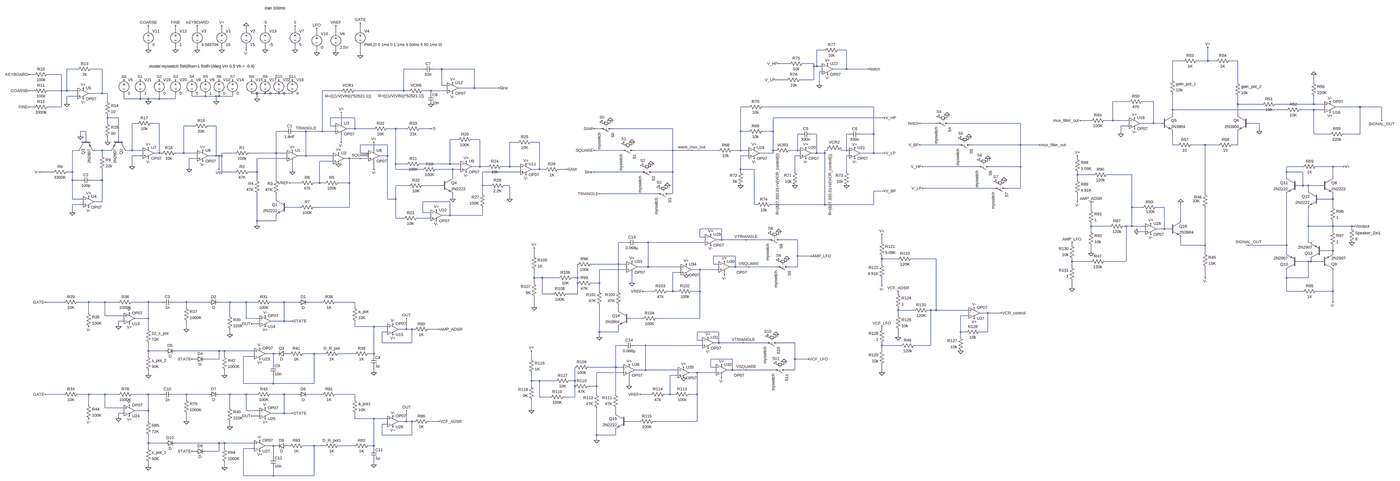
[diagram p0: schematic Synthesizer_Schematic.asc, whole sheet]
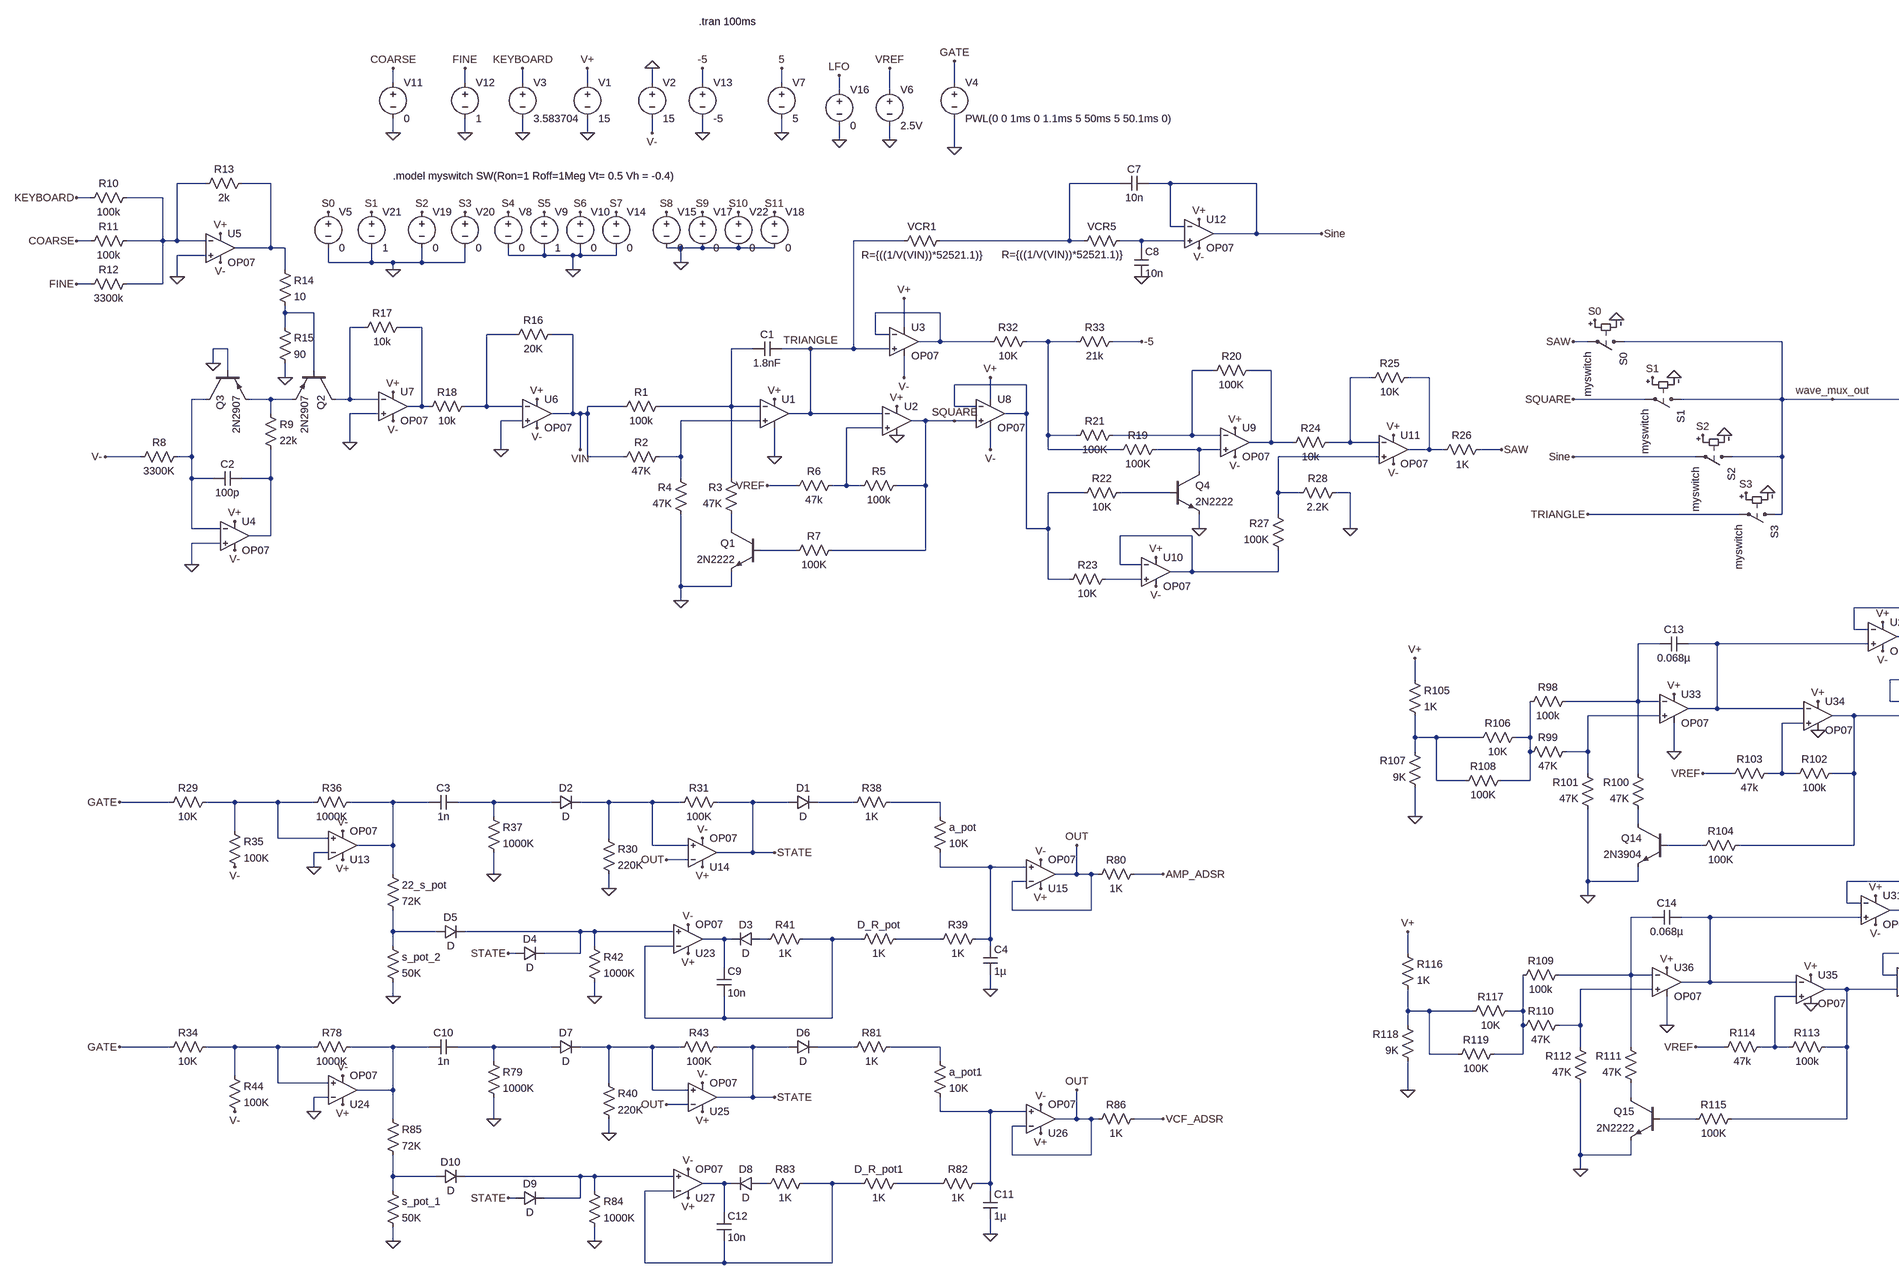
[diagram p1: schematic Synthesizer_Schematic.asc, part, row 1 of 1, column 1 of 2]
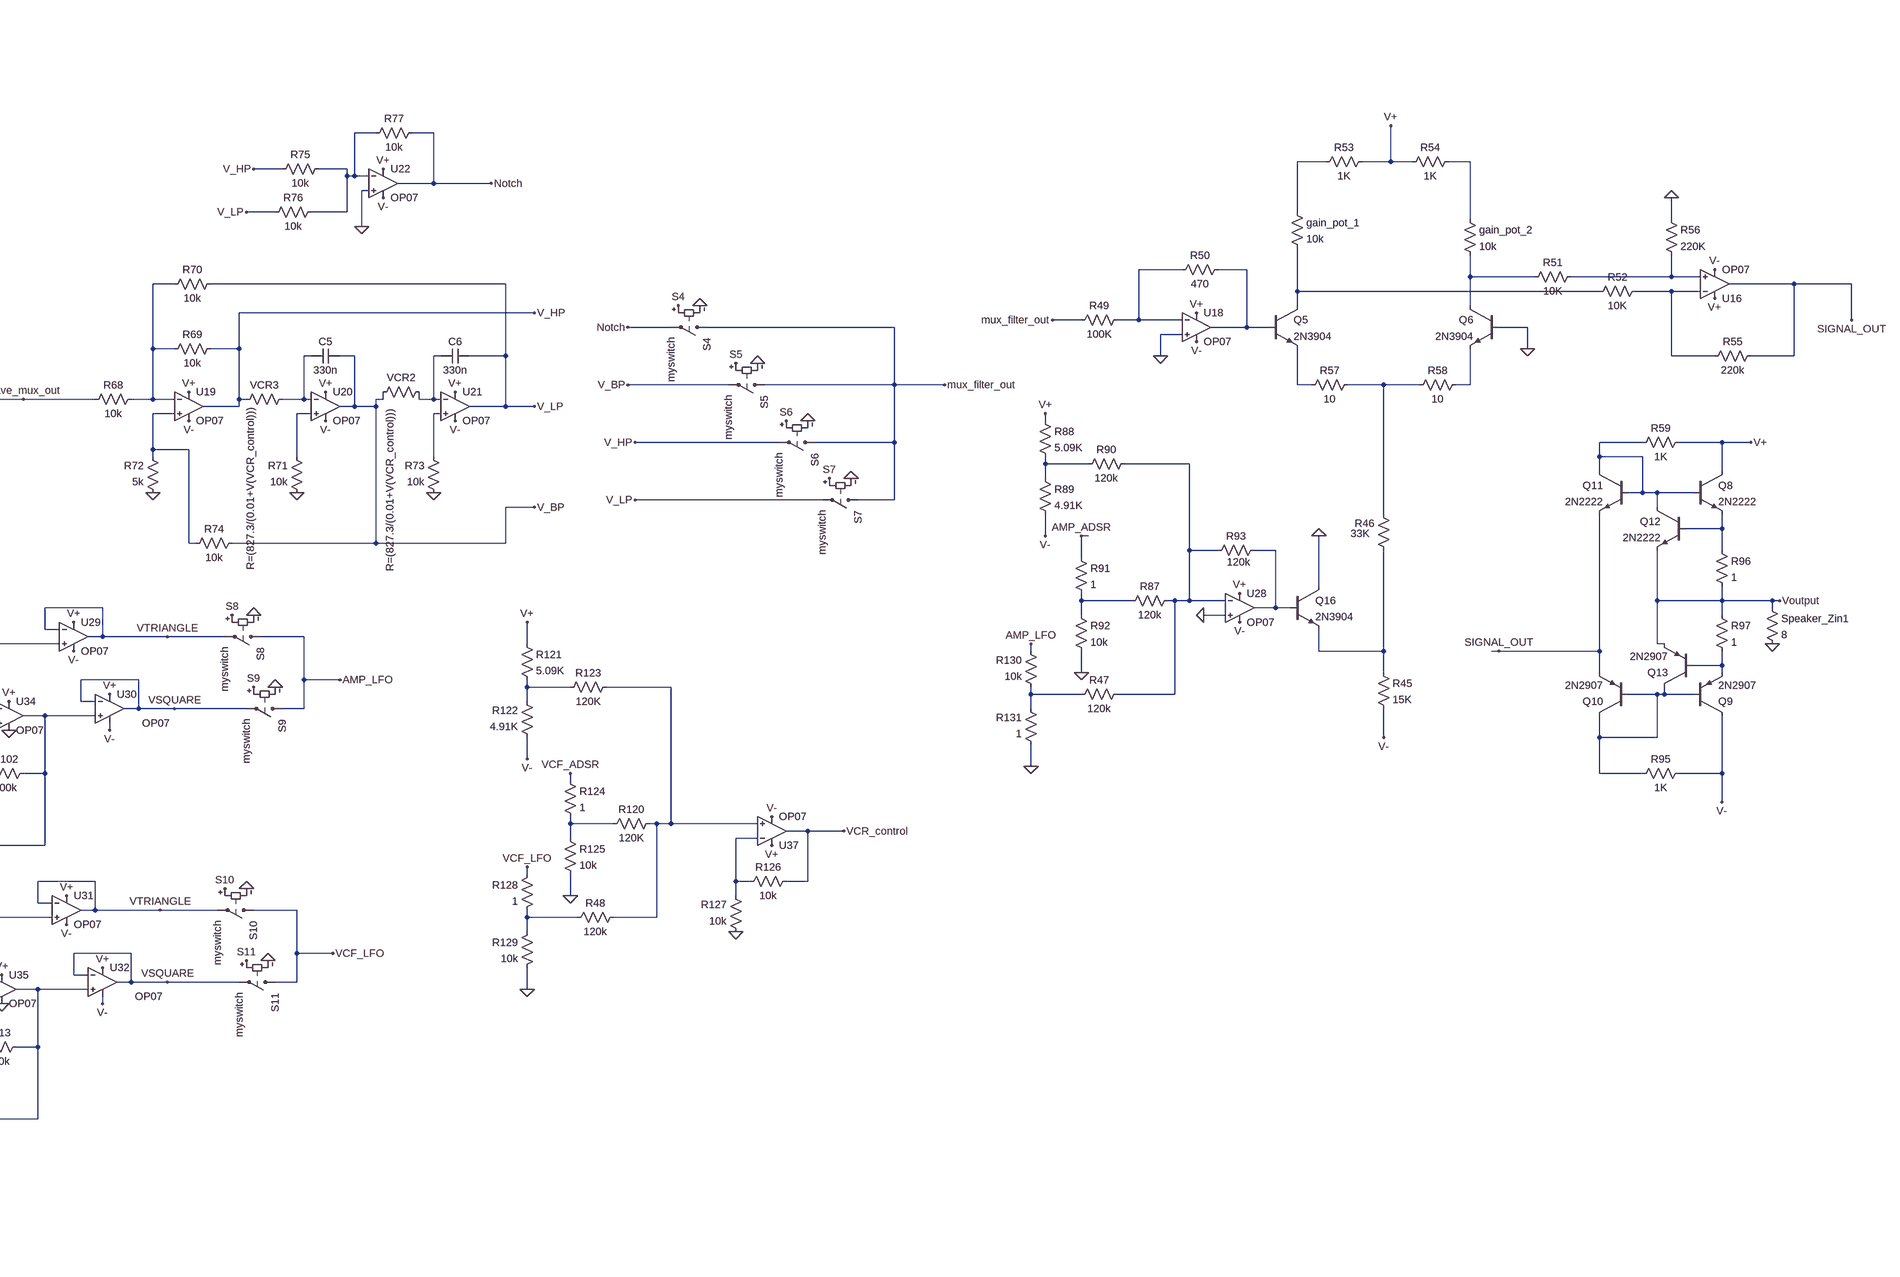
[diagram p2: schematic Synthesizer_Schematic.asc, part, row 1 of 1, column 2 of 2]
* Synthesizer_Schematic.asc
V1 V+ 0 15
V2 0 V- 15
V3 KEYBOARD 0 3.583704
XU1 N037 N021 V+ 0 TRIANGLE level.2 Avol=1Meg GBW=10Meg Slew=10Meg ilimit=25m rail=0 Vos=0 phimargin=45 en=0 enk=0 in=0 ink=0 Rin=500Meg  ; pins IN+ IN- V+ V- OUT
R1 N021 VIN 100k
R2 N037 VIN 47K
R3 N046 N021 47K
R4 0 N037 47K
Q1 N046 N049 0 0 2N2222
C1 TRIANGLE N021 1.8nF
XU2 N038 TRIANGLE V+ 0 SQUARE level.2 Avol=1Meg GBW=10Meg Slew=10Meg ilimit=25m rail=0 Vos=0 phimargin=45 en=0 enk=0 in=0 ink=0 Rin=500Meg  ; pins IN+ IN- V+ V- OUT
R5 SQUARE N038 100k
R6 N038 VREF 47k
R7 SQUARE N049 100K
V6 VREF 0 2.5V
XU3 TRIANGLE N016 V+ V- N016 LT1001  ; OP07, pins In+ In- V+ V- OUT
R8 N032 V- 3300K
R9 N033 N044 22k
C2 N044 N032 100p
XU4 0 N032 V+ V- N044 LT1001  ; OP07, pins In+ In- V+ V- OUT
XU5 0 N004 V+ V- N005 LT1001  ; OP07, pins In+ In- V+ V- OUT
R10 N004 KEYBOARD 100k
R11 N004 COARSE 100k
R12 N004 FINE 3300k
R13 N005 N004 2k
R14 N005 N015 10
R15 N015 0 90
Q2 N017 N015 N033 0 2N2907
Q3 N032 0 N033 0 2N2907
XU6 0 N019 V+ V- VIN LT1001  ; OP07, pins In+ In- V+ V- OUT
R16 VIN N019 20K
XU7 0 N017 V+ V- N018 LT1001  ; OP07, pins In+ In- V+ V- OUT
R17 N018 N017 10k
R18 N019 N018 10k
V7 5 0 5
V11 COARSE 0 0
V12 FINE 0 1
XU8 SQUARE N028 V+ V- N028 LT1001  ; OP07, pins In+ In- V+ V- OUT
XU9 N040 N024 V+ V- N025 LT1001  ; OP07, pins In+ In- V+ V- OUT
XU10 N051 N048 V+ V- N048 LT1001  ; OP07, pins In+ In- V+ V- OUT
XU11 N041 N026 V+ V- N027 LT1001  ; OP07, pins In+ In- V+ V- OUT
R19 N040 N020 100K
R20 N025 N024 100K
R21 N024 N020 100K
Q4 N040 N045 0 0 2N2222
R22 N045 N028 10K
R23 N051 N028 10K
R24 N026 N025 10k
R25 N027 N026 10K
R26 SAW N027 1K
R27 N048 N041 100K
R28 N041 0 2.2K
V13 -5 0 -5
R32 N016 N020 10K
R33 N020 -5 21k
Q5 N013 N009 N029 0 2N3904
Q6 N010 0 N031 0 2N3904
R§gain_pot_1 N002 N013 10k
R§gain_pot_2 N003 N010 10k
XU16 N011 N014 V+ V- SIGNAL_OUT LT1001  ; OP07, pins In+ In- V+ V- OUT
R45 N055 V- 15K
R46 N055 N030 33K
XU18 0 N008 V+ V- N009 LT1001  ; OP07, pins In+ In- V+ V- OUT
R49 N008 mux_filter_out 100K
R50 N009 N008 470
R51 N011 N010 10K
R52 N014 N013 10K
R53 V+ N002 1K
R54 N003 V+ 1K
R55 SIGNAL_OUT N014 220k
V16 LFO 0 0
R56 0 N011 220K
R57 N030 N029 10
R58 N031 N030 10
V4 GATE 0 PWL(0 0 1ms 0 1.1ms 5 50ms 5 50.1ms 0)
XU19 N034 N012 V+ V- V_HP LT1001  ; OP07, pins In+ In- V+ V- OUT
XU20 N035 N022 V+ V- V_BP LT1001  ; OP07, pins In+ In- V+ V- OUT
XU21 N036 N023 V+ V- V_LP LT1001  ; OP07, pins In+ In- V+ V- OUT
R68 N012 wave_mux_out 10k
R69 V_HP N012 10k
R70 V_LP N012 10k
R71 0 N035 10k
R72 0 N034 5k
R73 0 N036 10k
R74 N034 V_BP 10k
C5 V_BP N022 330n
C6 V_LP N023 330n
R§VCR3 N022 V_HP R=(827.3/(0.01+V(VCR_control)))
R75 N001 V_HP 10k
R76 N001 V_LP 10k
XU22 0 N001 V+ V- Notch LT1001  ; OP07, pins In+ In- V+ V- OUT
R77 Notch N001 10k
V19 S2 0 0
V20 S3 0 0
V5 S0 0 0
V21 S1 0 1
XU12 N007 Sine V+ V- Sine LT1001  ; OP07, pins In+ In- V+ V- OUT
C7 Sine N006 10n
C8 N007 0 10n
R§VCR1 N006 TRIANGLE R={((1/V(VIN))*52521.1)}
R§VCR5 N007 N006 R={((1/V(VIN))*52521.1)}
S1 wave_mux_out SQUARE S1 0 myswitch
S2 wave_mux_out Sine S2 0 myswitch
S3 wave_mux_out TRIANGLE S3 0 myswitch
S0 wave_mux_out SAW S0 0 myswitch
S5 mux_filter_out V_BP S5 0 myswitch
S6 mux_filter_out V_HP S6 0 myswitch
S7 mux_filter_out V_LP S7 0 myswitch
S4 mux_filter_out Notch S4 0 myswitch
V8 S4 0 0
V9 S5 0 1
V10 S6 0 0
V14 S7 0 0
XU13 N066 0 V+ V- N067 LT1001  ; OP07, pins In+ In- V+ V- OUT
XU14 N069 OUT V+ V- STATE LT1001  ; OP07, pins In+ In- V+ V- OUT
XU15 N076 OUT V+ V- OUT LT1001  ; OP07, pins In+ In- V+ V- OUT
XU23 N081 N084 V+ V- N082 LT1001  ; OP07, pins In+ In- V+ V- OUT
R29 N066 GATE 10K
R30 N069 0 220K
R31 STATE N069 100K
R§a_pot N071 N076 10K
R35 N066 V- 100K
R36 N067 N066 1000K
R37 N068 0 1000K
R38 N071 N070 1K
D1 STATE N070 D
D2 N068 N069 D
C3 N068 N067 1n
C4 N076 0 1µ
R39 N076 N085 1K
R§D_R_pot N085 N084 1K
R41 N083 N084 1K
D3 N083 N082 D
C9 N082 N084 10n
R42 N081 0 1000K
D4 STATE N081 D
D5 N080 N081 D
R§22_s_pot N067 N080 72K
R§s_pot_2 N080 0 50K
R80 AMP_ADSR OUT 1K
XU24 N091 0 V+ V- N092 LT1001  ; OP07, pins In+ In- V+ V- OUT
XU25 N094 OUT V+ V- STATE LT1001  ; OP07, pins In+ In- V+ V- OUT
XU26 N098 OUT V+ V- OUT LT1001  ; OP07, pins In+ In- V+ V- OUT
XU27 N101 N104 V+ V- N102 LT1001  ; OP07, pins In+ In- V+ V- OUT
R34 N091 GATE 10K
R40 N094 0 220K
R43 STATE N094 100K
R§a_pot1 N096 N098 10K
R44 N091 V- 100K
R78 N092 N091 1000K
R79 N093 0 1000K
R81 N096 N095 1K
D6 STATE N095 D
D7 N093 N094 D
C10 N093 N092 1n
C11 N098 0 1µ
R82 N098 N105 1K
R§D_R_pot1 N105 N104 1K
R83 N103 N104 1K
D8 N103 N102 D
C12 N102 N104 10n
R84 N101 0 1000K
D9 STATE N101 D
D10 N100 N101 D
R85 N092 N100 72K
R§s_pot_1 N100 0 50K
R86 VCF_ADSR OUT 1K
R§VCR2 N023 V_BP R=(827.3/(0.01+V(VCR_control)))
R§Speaker_Zin1 Voutput 0 8
R59 V+ N039 1K
R95 V- N060 1K
Q8 V+ N039 N047 0 2N2222
Q9 V- N060 N056 0 2N2907
Q10 N060 N060 SIGNAL_OUT 0 2N2907
Q11 N039 N039 SIGNAL_OUT 0 2N2222
R96 N047 Voutput 1
R97 Voutput N056 1
Q12 N039 N047 Voutput 0 2N2222
Q13 N060 N056 Voutput 0 2N2907
R98 N053 N065 100k
R99 N061 N065 47K
R100 N072 N053 47K
R101 0 N061 47K
Q14 N072 N075 0 0 2N3904
R102 N062 N063 100k
R103 N063 VREF 47k
R104 N062 N075 100K
R105 V+ N064 1K
R106 N065 N064 10K
R107 0 N064 9K
R108 N065 N064 100K
C13 N054 N053 0.068µ
XU29 N054 VTRIANGLE V+ V- VTRIANGLE LT1001  ; OP07, pins In+ In- V+ V- OUT
XU30 N062 VSQUARE V+ V- VSQUARE LT1001  ; OP07, pins In+ In- V+ V- OUT
S8 AMP_LFO VTRIANGLE S8 0 myswitch
S9 AMP_LFO VSQUARE S9 0 myswitch
R109 N077 N090 100k
R110 N086 N090 47K
R111 N097 N077 47K
R112 0 N086 47K
Q15 N097 N099 0 0 2N2222
R113 N087 N088 100k
R114 N088 VREF 47k
R115 N087 N099 100K
R116 V+ N089 1K
R117 N090 N089 10K
R118 0 N089 9K
R119 N090 N089 100K
C14 N078 N077 0.068µ
XU31 N078 VTRIANGLE V+ V- VTRIANGLE LT1001  ; OP07, pins In+ In- V+ V- OUT
XU32 N087 VSQUARE V+ V- VSQUARE LT1001  ; OP07, pins In+ In- V+ V- OUT
S10 VCF_LFO VTRIANGLE S10 0 myswitch
S11 VCF_LFO VSQUARE S11 0 myswitch
XU33 N061 N053 V+ 0 N054 LT1001  ; OP07, pins In+ In- V+ V- OUT
XU34 N063 N054 V+ 0 N062 LT1001  ; OP07, pins In+ In- V+ V- OUT
XU35 N088 N078 V+ 0 N087 LT1001  ; OP07, pins In+ In- V+ V- OUT
XU36 N086 N077 V+ 0 N078 LT1001  ; OP07, pins In+ In- V+ V- OUT
XU37 N058 N074 V+ V- VCR_control LT1001  ; OP07, pins In+ In- V+ V- OUT
R120 N058 N073 120K
R121 V+ N057 5.09K
R122 V- N057 4.91K
R123 N058 N057 120K
R124 VCF_ADSR N073 1
R125 N073 0 10k
R126 VCR_control N074 10k
R127 0 N074 10k
R128 VCF_LFO N079 1
R129 N079 0 10k
Q16 0 N050 N055 0 2N3904
XU28 0 N043 V+ V- N050 LT1001  ; OP07, pins In+ In- V+ V- OUT
R87 N043 N052 120k
R88 V+ N042 5.09K
R89 N042 V- 4.91K
R90 N043 N042 120k
R91 AMP_ADSR N052 1
R92 N052 0 10k
R93 N050 N043 120k
R130 N059 AMP_LFO 10k
R131 0 N059 1
R47 N043 N059 120k
R48 N058 N079 120k
V17 S9 0 0
V15 S8 0 0
V18 S11 0 0
V22 S10 0 0
.model D D
.lib standard.dio
.model NPN NPN
.model PNP PNP
.lib standard.bjt
.tran 100ms
.model myswitch SW(Ron=1 Roff=1Meg Vt= 0.5 Vh = -0.4)
.lib UniversalOpamps2.sub
.lib LTC.lib
.backanno
.end